# Altium schematic sheet acestat_355.SchDoc: ACEstat
size 419 x 296 mm; ApprovedBy: Jason Ray; Revision: 2.0.0; SheetNumber: 1; SheetTotal: 5; ProjectTitle: Mobile Environmental Contaminant Sensors Program; BranchName: Sensor Integration Branch
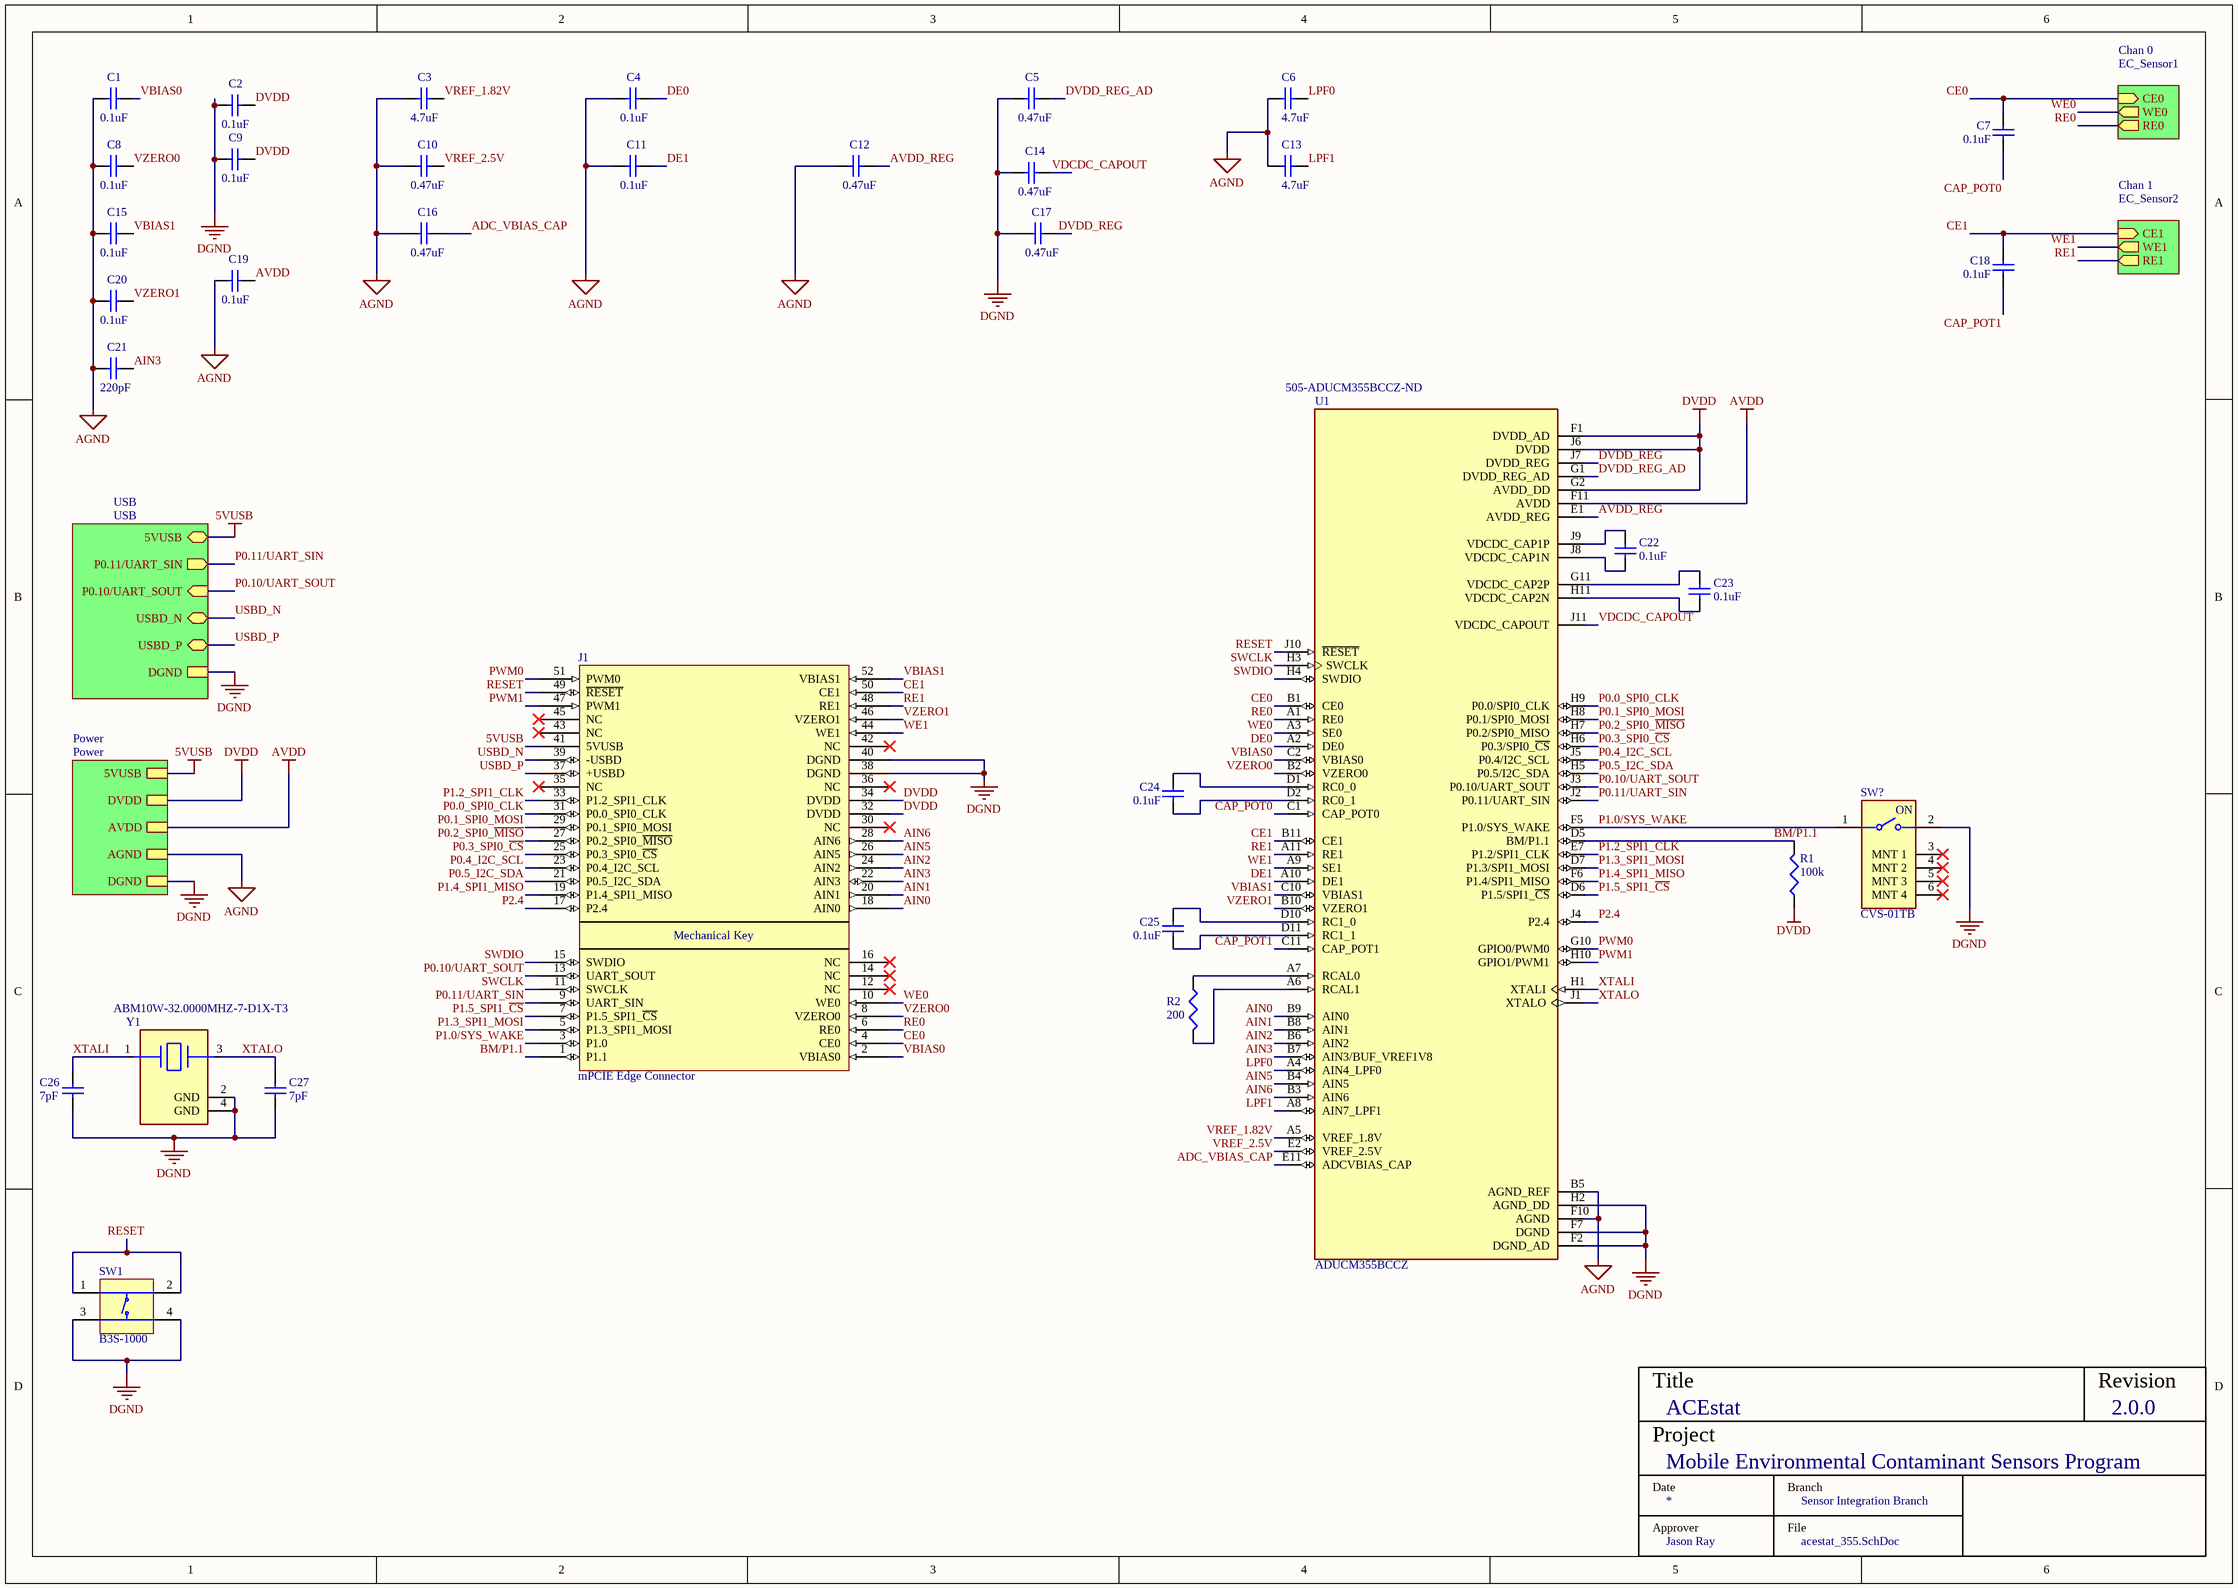
[diagram p0: acestat_355.SchDoc]

## Parts
C1  value 0.1uF  [0402 SMD]  (hidden comment: C0402C104K4RAC7867)
C2  value 0.1uF  [0402 SMD]  (hidden comment: C0402C104K4RAC7867)
C3  value 4.7uF  [0402 SMD]  (hidden comment: C0402C475M7PAC7867)
C4  value 0.1uF  [0402 SMD]  (hidden comment: C0402C104K4RAC7867)
C5  value 0.47uF  [0402 SMD]  (hidden comment: C0402C474K9PAC7867)
C6  value 4.7uF  [0402 SMD]  (hidden comment: CL05A475KQ5NRNC)
C7  value 0.1uF  [0402 SMD]  (hidden comment: C0402C104K4RAC7867)
C8  value 0.1uF  [0402 SMD]  (hidden comment: C0402C104K4RAC7867)
C9  value 0.1uF  [0402 SMD]  (hidden comment: C0402C104K4RAC7867)
C10  value 0.47uF  [0402 SMD]  (hidden comment: C0402C474K9PAC7867)
C11  value 0.1uF  [0402 SMD]  (hidden comment: C0402C104K4RAC7867)
C12  value 0.47uF  [0402 SMD]  (hidden comment: C0402C474K9PAC7867)
C13  value 4.7uF  [0402 SMD]  (hidden comment: CL05A475KQ5NRNC)
C14  value 0.47uF  [0402 SMD]  (hidden comment: C0402C474K9PAC7867)
C15  value 0.1uF  [0402 SMD]  (hidden comment: C0402C104K4RAC7867)
C16  value 0.47uF  [0402 SMD]  (hidden comment: C0402C474K9PAC7867)
C17  value 0.47uF  [0402 SMD]  (hidden comment: C0402C474K9PAC7867)
C18  value 0.1uF  [0402 SMD]  (hidden comment: C0402C104K4RAC7867)
C19  value 0.1uF  [0402 SMD]  (hidden comment: C0402C104K4RAC7867)
C20  value 0.1uF  [0402 SMD]  (hidden comment: C0402C104K4RAC7867)
C21  value 220pF  [0402 SMD]  (hidden comment: C0402C221K5RAC7867)
C22  value 0.1uF  [0402 SMD]  (hidden comment: C0402C104K4RAC7867)
C23  value 0.1uF  [0402 SMD]  (hidden comment: C0402C104K4RAC7867)
C24  value 0.1uF  [0402 SMD]  (hidden comment: C0402C104K4RAC7867)
C25  value 0.1uF  [0402 SMD]  (hidden comment: C0402C104K4RAC7867)
C26  value 7pF  [0402 SMD]  (hidden comment: CBR04C709B5GAC)
C27  value 7pF  [0402 SMD]  (hidden comment: CBR04C709B5GAC)
J1  mPCIE Edge Connector  [MPCIE_CARD_EDGE]
R1  value 100k  [0402 SMD]  (hidden comment: RC0402FR-07100KL)
R2  value 200  [0402 SMD]  (hidden comment: RN73C1E200RBTD)
SW1  B3S-1000  [OMRON-B3S-1000-4_V]
SW?  CVS-01TB  [FP-CVS-01TB-MFG]
U1  ADUCM355BCCZ  Supplier Part Number 1: 505-ADUCM355BCCZ-ND  [ADUCM355BCCZ]
Y1  ABM10W-32.0000MHZ-7-D1X-T3  [FP-ABM10W-MFG]

## Sub-sheets
Chan 0 = EC_Sensor1: CE0 (in), WE0 (out), RE0 (out)
Chan 1 = EC_Sensor2: CE1 (in), WE1 (out), RE1 (out)
Power = Power: 5VUSB, DVDD, AVDD, DGND, AGND
USB = USB: 5VUSB (bidir), P0.11/UART_SIN (out), P0.10/UART_SOUT (in), DGND, USBD_N (bidir), USBD_P (bidir)

## Nets
5VUSB: J1.41(5VUSB) ; sheet USB/5VUSB, sheet Power/5VUSB
AGND: C1.1 C3.1 C4.1 C6.1 C8.1 C10.1 C11.1 C12.1 C13.1 C15.1 C16.1 C19.1 C20.1 C21.1 U1.B5(AGND_REF) U1.F10(AGND) ; sheet Power/AGND
AVDD: C19.2 U1.F11(AVDD) ; sheet Power/AVDD
DGND: C2.1 C5.1 C9.1 C14.1 C17.1 C26.1 C27.1 J1.38(DGND) J1.40(DGND) SW1.3 SW1.4 SW?.2 U1.F2(DGND_AD) U1.F7(DGND) U1.H2(AGND_DD) Y1.2(GND) Y1.4(GND) ; sheet USB/DGND, sheet Power/DGND
DVDD: C2.2 C9.2 J1.32(DVDD) J1.34(DVDD) R1.1 U1.F1(DVDD_AD) U1.G2(AVDD_DD) U1.J6(DVDD) ; sheet Power/DVDD
ADC_VBIAS_CAP: C16.2 U1.E11(ADCVBIAS_CAP)
AIN0: J1.18(AIN0) U1.B9(AIN0)
AIN1: J1.20(AIN1) U1.B8(AIN1)
AIN2: J1.24(AIN2) U1.B6(AIN2)
AIN3: C21.2 J1.22(AIN3) U1.B7(AIN3/BUF_VREF1V8)
AIN5: J1.26(AIN5) U1.B4(AIN5)
AIN6: J1.28(AIN6) U1.B3(AIN6)
AVDD_REG: C12.2 U1.E1(AVDD_REG)
BM/P1.1: J1.1(P1.1) R1.2 U1.D5(BM/P1.1)
CAP_POT0: C7.2 U1.C1(CAP_POT0)
CAP_POT1: C18.2 U1.C11(CAP_POT1)
CE0: C7.1 J1.4(CE0) U1.B1(CE0) ; sheet Chan 0/CE0
CE1: C18.1 J1.50(CE1) U1.B11(CE1) ; sheet Chan 1/CE1
DE0: C4.2 U1.A2(DE0)
DE1: C11.2 U1.A10(DE1)
DVDD_REG: C17.2 U1.J7(DVDD_REG)
DVDD_REG_AD: C5.2 U1.G1(DVDD_REG_AD)
LPF0: C6.2 U1.A4(AIN4_LPF0)
LPF1: C13.2 U1.A8(AIN7_LPF1)
P0.0_SPI0_CLK: J1.31(P0.0_SPI0_CLK) U1.H9(P0.0/SPI0_CLK)
P0.1_SPI0_MOSI: J1.29(P0.1_SPI0_MOSI) U1.H8(P0.1/SPI0_MOSI)
P0.2_SPI0_~{MISO}: J1.27(P0.2_SPI0_~{MISO}) U1.H7(P0.2/SPI0_MISO)
P0.3_SPI0_~{CS}: J1.25(P0.3_SPI0_~{CS}) U1.H6(P0.3/SPI0_~{CS})
P0.4_I2C_SCL: J1.23(P0.4_I2C_SCL) U1.J5(P0.4/I2C_SCL)
P0.5_I2C_SDA: J1.21(P0.5_I2C_SDA) U1.H5(P0.5/I2C_SDA)
P0.10/UART_SOUT: J1.13(UART_SOUT) U1.J3(P0.10/UART_SOUT) ; sheet USB/P0.10/UART_SOUT
P0.11/UART_SIN: J1.9(UART_SIN) U1.J2(P0.11/UART_SIN) ; sheet USB/P0.11/UART_SIN
P1.0/SYS_WAKE: J1.3(P1.0) SW?.1 U1.F5(P1.0/SYS_WAKE)
P1.2_SPI1_CLK: J1.33(P1.2_SPI1_CLK) U1.E7(P1.2/SPI1_CLK)
P1.3_SPI1_MOSI: J1.5(P1.3_SPI1_MOSI) U1.D7(P1.3/SPI1_MOSI)
P1.4_SPI1_MISO: J1.19(P1.4_SPI1_MISO) U1.F6(P1.4/SPI1_MISO)
P1.5_SPI1_~{CS}: J1.7(P1.5_SPI1_~{CS}) U1.D6(P1.5/SPI1_~{CS})
P2.4: J1.17(P2.4) U1.J4(P2.4)
PWM0: J1.51(PWM0) U1.G10(GPIO0/PWM0)
PWM1: J1.47(PWM1) U1.H10(GPIO1/PWM1)
RE0: J1.6(RE0) U1.A1(RE0) ; sheet Chan 0/RE0
RE1: J1.48(RE1) U1.A11(RE1) ; sheet Chan 1/RE1
RESET: J1.49(~{RESET}) SW1.1 SW1.2 U1.J10(~{RESET})
SWCLK: J1.11(SWCLK) U1.H3(SWCLK)
SWDIO: J1.15(SWDIO) U1.H4(SWDIO)
USBD_N: J1.39(-USBD) ; sheet USB/USBD_N
USBD_P: J1.37(+USBD) ; sheet USB/USBD_P
VBIAS0: C1.2 J1.2(VBIAS0) U1.C2(VBIAS0)
VBIAS1: C15.2 J1.52(VBIAS1) U1.C10(VBIAS1)
VDCDC_CAPOUT: C14.2 U1.J11(VDCDC_CAPOUT)
VREF_1.82V: C3.2 U1.A5(VREF_1.8V)
VREF_2.5V: C10.2 U1.E2(VREF_2.5V)
VZERO0: C8.2 J1.8(VZERO0) U1.B2(VZERO0)
VZERO1: C20.2 J1.46(VZERO1) U1.B10(VZERO1)
WE0: J1.10(WE0) U1.A3(SE0) ; sheet Chan 0/WE0
WE1: J1.44(WE1) U1.A9(SE1) ; sheet Chan 1/WE1
XTALI: C26.2 U1.H1(XTALI) Y1.1
XTALO: C27.2 U1.J1(XTALO) Y1.3
NetC22_1: C22.1 U1.J8(VDCDC_CAP1N)
NetC22_2: C22.2 U1.J9(VDCDC_CAP1P)
NetC23_1: C23.1 U1.H11(VDCDC_CAP2N)
NetC23_2: C23.2 U1.G11(VDCDC_CAP2P)
NetC24_1: C24.1 U1.D1(RC0_0)
NetC24_2: C24.2 U1.D2(RC0_1)
NetC25_1: C25.1 U1.D10(RC1_0)
NetC25_2: C25.2 U1.D11(RC1_1)
NetR2_1: R2.1 U1.A7(RCAL0)
NetR2_2: R2.2 U1.A6(RCAL1)

Not connected (* = marked no-connect by the designer): J1 12(NC)* 14(NC)* 16(NC)* 30(NC)* 35(NC)* 36(NC)* 42(NC)* 43(NC)* 45(NC)*; SW? 3(MNT_1)* 4(MNT_2)* 5(MNT_3)* 6(MNT_4)*

## Notes on the sheet
- Title
- Revision
- Project
- Approver
- Date
- Branch
- File
- (in symbol CMP-011-00013-1) ON
- (in symbol mPCIE_Edge) Mechanical Key

## Library data of the parts
C1 C2 C4 C7-C9 C11 C15 C18-C20 C22-C25 = C0402C104K4RAC7867: 0.1 µF ±10% 16V Ceramic Capacitor X7R 0402 (1005 Metric) Kemet
C3 = C0402C475M7PAC7867: 4.7 µF ±20% 4V Ceramic Capacitor X5R 0402 (1005 Metric) (1005 Metric) Kemet
C5 C10 C12 C14 C16 C17 = C0402C474K9PAC7867: 0.47 µF ±10% 6.3V Ceramic Capacitor X5R 0402 (1005 Metric) Kemet
C6 C13 = CL05A475KQ5NRNC: 4.7 µF ±10% 6.3V Ceramic Capacitor X5R 0402 (1005 Metric) Samsung
C21 = C0402C221K5RAC7867: 220 pF ±10% 50V Ceramic Capacitor X7R 0402 (1005 Metric)Kemet
C26 C27 = CBR04C709B5GAC: 7 pF ±0.1pF 50V Ceramic Capacitor C0G, NP0 0402 (1005 Metric) Kemet
J1 = mPCIE_Edge
R1 = RC0402FR-07100KL: 100 kOhms ±1% 0.063W, 1/16W Chip Resistor 0402 (1005 Metric) Moisture Resistant Thick Film
R2 = RN73C1E200RBTD: 200 Ohms ±0.1% 0.063W, 1/16W Chip Resistor 0402 (1005 Metric) Thin Film
SW1 = CMP-1677-00001-4: Sealed Tactile Switch, SPST-NO, 3 to 24 V, -25 to 70 degC, 4-Pin SMD, RoHS, Bulk; Manufacturer: Omron; Voltage Rating: 24 V; Current Rating: 50 mA; Contact Plating: Silver; ComponentLink1Description: Manufacturer URL; Packaging: Bulk; Package Quantity: 1500; Min Operating Temperature: -25 degC; Max Operating Temperature: 70 degC; REACH SVHC: No SVHC; ComponentLink1URL: http://www.omron.com/; RoHSCompliant: true; PackageDescription: 4-Pin Surface Mount Device, Body 6.6 x 6 mm; ComponentLink2URL: http://www.omron.com/ecb/products/pdf/en-b3s.pdf; DatasheetVersion: 10/2014; Length: 6.6 mm; Height: 4.3 mm; ComponentLink2Description: Datasheet; Mount: Surface Mount; Mounting Technology: Surface Mount; PackageReference: B3S-1000
SW? = CMP-011-00013-1: Switch Slide OFF ON SPST Recessed Slide 0.1A 24VDC Gull Wing SMD Embossed T/R
U1 = ADUCM355BCCZ: ARM® Cortex®-M3 ADuCM Microcontroller IC 32-Bit 26MHz 128KB _128K x 8_ FLASH 72-LGA _6x6_; MF: Analog Devices; SnapEDA_Link: https://www.snapeda.com/parts/ADUCM355BCCZ/Analog%20Devices%20Inc./view-part/3616453/?ref=snap; Value: *; Digi-Key_Part_Number: ADUCM355BCCZ-RL7-ND; Digi-Key_Purchase_URL: https://www.digikey.com/product-detail/en/analog-devices-inc/ADUCM355BCCZ-RL7/ADUCM355BCCZ-RL7-ND/9996949?utm_source=snapeda&utm_medium=aggregator&utm_campaign=symbol; MP: ADUCM355BCCZ; Package: VFLGA-72 Analog Devices Inc.; Supplier 1: Digi-Key
Y1 = CMP-27762-001052-1: Crystal 32MHz ±10ppm 7pF SMD-4 2.5mm x 2mm